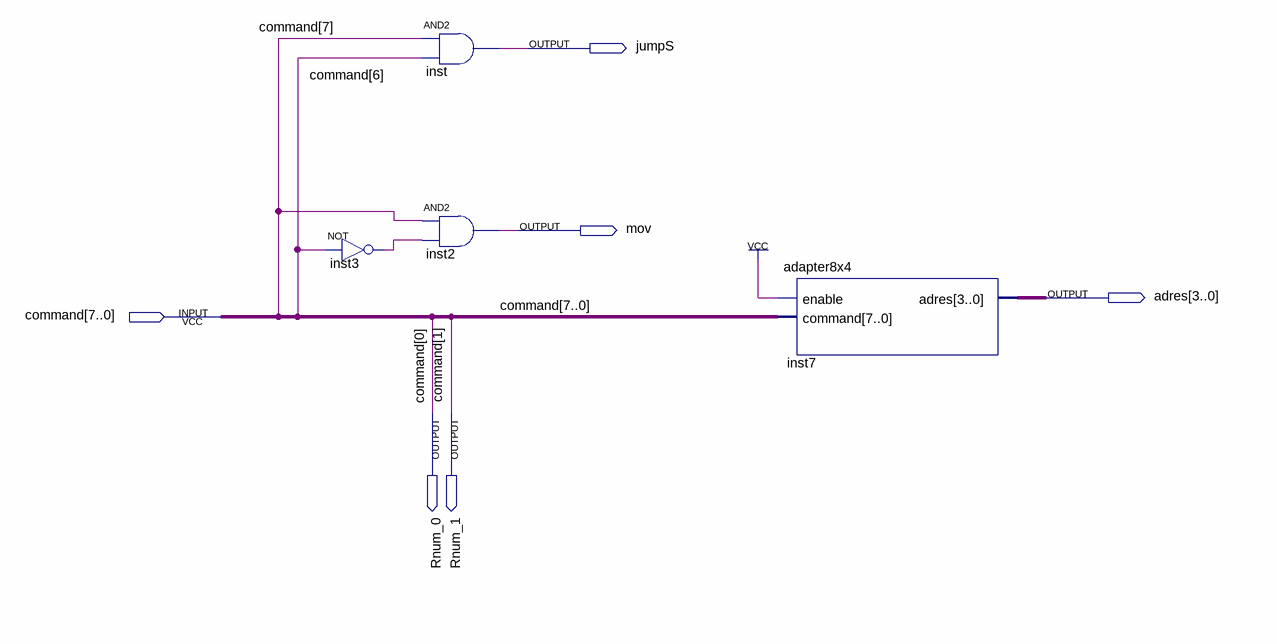
[diagram p0: schematic sheet]
// Quartus schematic commandDecoder.bdf as structural Verilog: 4 symbols, 6 pins
module commandDecoder (
  input  [7:0] command,
  output jumpS,
  output mov,
  output [3:0] adres,
  output Rnum_0,
  output Rnum_1
);

  wire inst3_out;

  not inst3 (inst3_out, command[6]);
  and inst (jumpS, command[7], command[6]);
  and inst2 (mov, command[7], inst3_out);
  adapter8x4 inst7 (.enable(1'b1), .command(command), .adres(adres));

  assign Rnum_0 = command[0];
  assign Rnum_1 = command[1];
endmodule
